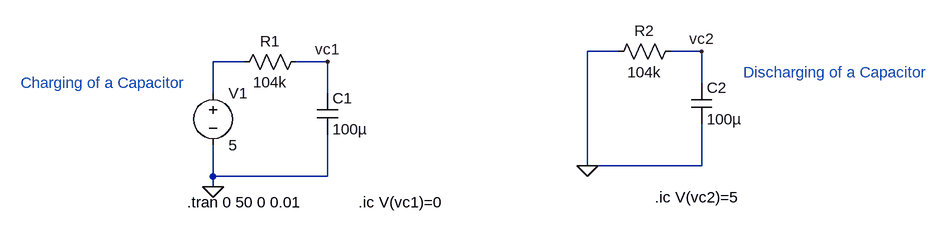
[diagram p0: schematic RC_via_DC.asc]
RC_via_DC.asc, the LTspice schematic file:
Version 4.1
SHEET 1 1224 680
WIRE 720 48 672 48
WIRE 848 48 800 48
WIRE 144 64 96 64
WIRE 272 64 224 64
WIRE 848 96 848 48
WIRE 96 112 96 64
WIRE 272 112 272 64
WIRE 672 224 672 48
WIRE 848 224 848 160
WIRE 848 224 672 224
WIRE 96 240 96 192
WIRE 272 240 272 176
WIRE 272 240 96 240
WIRE 96 256 96 240
FLAG 96 256 0
FLAG 272 64 vc1
FLAG 848 48 vc2
FLAG 672 224 0
SYMBOL voltage 96 96 R0
WINDOW 123 0 0 Left 0
WINDOW 39 0 0 Left 0
SYMATTR InstName V1
SYMATTR Value 5
SYMBOL res 240 48 R90
WINDOW 0 0 56 VBottom 2
WINDOW 3 32 56 VTop 2
SYMATTR InstName R1
SYMATTR Value 104k
SYMBOL cap 256 112 R0
SYMATTR InstName C1
SYMATTR Value 100µ
SYMATTR SpiceLine V=50
SYMBOL res 816 32 R90
WINDOW 0 0 56 VBottom 2
WINDOW 3 32 56 VTop 2
SYMATTR InstName R2
SYMATTR Value 104k
SYMBOL cap 832 96 R0
SYMATTR InstName C2
SYMATTR Value 100µ
SYMATTR SpiceLine V=50
TEXT 56 280 Left 2 !.tran 0 50 0 0.01
TEXT 320 280 Left 2 !.ic V(vc1)=0
TEXT 776 272 Left 2 !.ic V(vc2)=5
TEXT -200 96 Left 2 ;Charging of a Capacitor
TEXT 912 80 Left 2 ;Discharging of a Capacitor

The netlist it stands for:
* RC_via_DC.asc
V1 N001 0 5
R1 vc1 N001 104k
C1 vc1 0 100µ V=50
R2 vc2 0 104k
C2 vc2 0 100µ V=50
.tran 0 50 0 0.01
.ic V(vc1)=0
.ic V(vc2)=5
* Charging of a Capacitor
* Discharging of a Capacitor
.backanno
.end